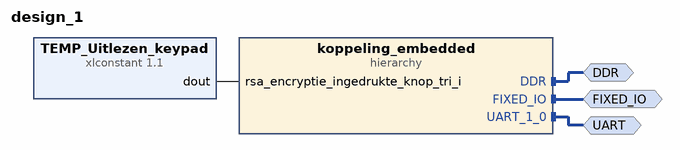
[diagram p0: block diagram of the top level]
# Vivado block design design_1, xc7z020clg400-1, Vivado 2023.1
create_bd_design design_1

create_bd_intf_port -mode Master -vlnv xilinx.com:interface:ddrx_rtl:1.0 DDR
create_bd_intf_port -mode Master -vlnv xilinx.com:display_processing_system7:fixedio_rtl:1.0 FIXED_IO
create_bd_intf_port -mode Master -vlnv xilinx.com:interface:uart_rtl:1.0 UART

create_bd_cell -type hier koppeling_embedded
create_bd_cell -type ip -vlnv xilinx.com:ip:xlconstant:1.1 TEMP_Uitlezen_keypad
set_property -dict {CONFIG.CONST_VAL 8 CONFIG.CONST_WIDTH 4} [get_bd_cells TEMP_Uitlezen_keypad]

# ---- hierarchy /koppeling_embedded ----
current_bd_instance /koppeling_embedded
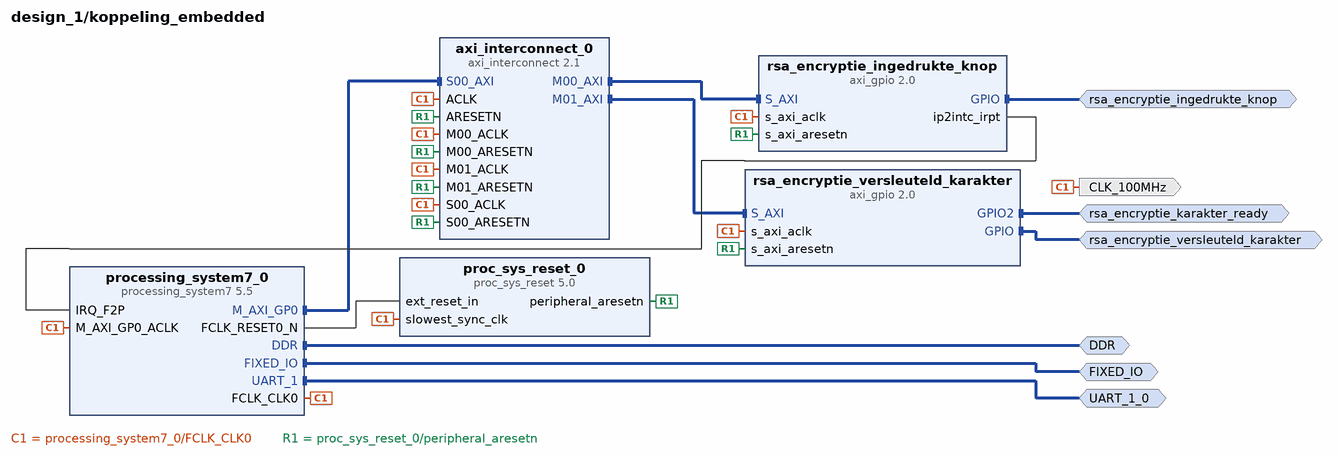
[diagram p1: block diagram inside /koppeling_embedded]
create_bd_intf_pin -mode Master -vlnv xilinx.com:interface:ddrx_rtl:1.0 DDR
create_bd_intf_pin -mode Master -vlnv xilinx.com:display_processing_system7:fixedio_rtl:1.0 FIXED_IO
create_bd_intf_pin -mode Master -vlnv xilinx.com:interface:gpio_rtl:1.0 rsa_encryptie_ingedrukte_knop
create_bd_intf_pin -mode Master -vlnv xilinx.com:interface:uart_rtl:1.0 UART_1_0
create_bd_intf_pin -mode Master -vlnv xilinx.com:interface:gpio_rtl:1.0 rsa_encryptie_versleuteld_karakter
create_bd_intf_pin -mode Master -vlnv xilinx.com:interface:gpio_rtl:1.0 rsa_encryptie_karakter_ready
create_bd_pin -dir O -type clk CLK_100MHz

create_bd_cell -type ip -vlnv xilinx.com:ip:axi_interconnect:2.1 axi_interconnect_0
create_bd_cell -type ip -vlnv xilinx.com:ip:proc_sys_reset:5.0 proc_sys_reset_0
create_bd_cell -type ip -vlnv xilinx.com:ip:axi_gpio:2.0 rsa_encryptie_versleuteld_karakter
set_property -dict [list \
  CONFIG.C_ALL_OUTPUTS 1 \
  CONFIG.C_ALL_OUTPUTS_2 1 \
  CONFIG.C_GPIO2_WIDTH 1 \
  CONFIG.C_IS_DUAL 1 \
] [get_bd_cells rsa_encryptie_versleuteld_karakter]
create_bd_cell -type ip -vlnv xilinx.com:ip:axi_gpio:2.0 rsa_encryptie_ingedrukte_knop
set_property -dict [list \
  CONFIG.C_ALL_INPUTS 1 \
  CONFIG.C_GPIO_WIDTH 4 \
  CONFIG.C_INTERRUPT_PRESENT 1 \
] [get_bd_cells rsa_encryptie_ingedrukte_knop]
create_bd_cell -type ip -vlnv xilinx.com:ip:processing_system7:5.5 processing_system7_0
set_property -dict [list \
  CONFIG.PCW_APU_PERIPHERAL_FREQMHZ 650 \
  CONFIG.PCW_CRYSTAL_PERIPHERAL_FREQMHZ 50 \
  CONFIG.PCW_ENET0_PERIPHERAL_ENABLE 0 \
  CONFIG.PCW_FPGA0_PERIPHERAL_FREQMHZ 100 \
  CONFIG.PCW_FPGA1_PERIPHERAL_FREQMHZ 50 \
  CONFIG.PCW_GPIO_MIO_GPIO_ENABLE 1 \
  CONFIG.PCW_GPIO_MIO_GPIO_IO MIO \
  CONFIG.PCW_I2C_RESET_ENABLE 0 \
  CONFIG.PCW_IRQ_F2P_INTR 1 \
  CONFIG.PCW_M_AXI_GP0_FREQMHZ 10 \
  CONFIG.PCW_PERIPHERAL_BOARD_PRESET part0 \
  CONFIG.PCW_PRESET_BANK1_VOLTAGE {LVCMOS 1.8V} \
  CONFIG.PCW_QSPI_GRP_FBCLK_ENABLE 1 \
  CONFIG.PCW_QSPI_GRP_FBCLK_IO {MIO 8} \
  CONFIG.PCW_QSPI_GRP_SINGLE_SS_ENABLE 1 \
  CONFIG.PCW_QSPI_GRP_SINGLE_SS_IO {MIO 1 .. 6} \
  CONFIG.PCW_QSPI_PERIPHERAL_ENABLE 1 \
  CONFIG.PCW_QSPI_QSPI_IO {MIO 1 .. 6} \
  CONFIG.PCW_SD0_PERIPHERAL_ENABLE 0 \
  CONFIG.PCW_SINGLE_QSPI_DATA_MODE x4 \
  CONFIG.PCW_UART0_PERIPHERAL_ENABLE 1 \
  CONFIG.PCW_UART0_UART0_IO {MIO 14 .. 15} \
  CONFIG.PCW_UART1_PERIPHERAL_ENABLE 1 \
  CONFIG.PCW_UART1_UART1_IO EMIO \
  CONFIG.PCW_UART_PERIPHERAL_FREQMHZ 100 \
  CONFIG.PCW_UIPARAM_DDR_BUS_WIDTH {16 Bit} \
  CONFIG.PCW_UIPARAM_DDR_FREQ_MHZ 525 \
  CONFIG.PCW_UIPARAM_DDR_PARTNO {MT41J256M16 RE-125} \
  CONFIG.PCW_USB0_PERIPHERAL_ENABLE 0 \
  CONFIG.PCW_USB_RESET_ENABLE 1 \
  CONFIG.PCW_USE_FABRIC_INTERRUPT 1 \
] [get_bd_cells processing_system7_0]
# 490 more settings of processing_system7_0 are not shown: defaults, MIO pin electricals, DDR timing, and values the tool derives

# ---- connections ----

current_bd_instance /koppeling_embedded
connect_bd_intf_net [get_bd_intf_pins processing_system7_0/DDR] [get_bd_intf_pins DDR]
connect_bd_intf_net [get_bd_intf_pins processing_system7_0/FIXED_IO] [get_bd_intf_pins FIXED_IO]
connect_bd_intf_net [get_bd_intf_pins rsa_encryptie_ingedrukte_knop/GPIO] [get_bd_intf_pins rsa_encryptie_ingedrukte_knop]
connect_bd_intf_net [get_bd_intf_pins rsa_encryptie_versleuteld_karakter/GPIO2] [get_bd_intf_pins rsa_encryptie_karakter_ready]
connect_bd_intf_net [get_bd_intf_pins processing_system7_0/UART_1] [get_bd_intf_pins UART_1_0]
connect_bd_intf_net [get_bd_intf_pins rsa_encryptie_versleuteld_karakter/GPIO] [get_bd_intf_pins rsa_encryptie_versleuteld_karakter]
connect_bd_intf_net [get_bd_intf_pins axi_interconnect_0/S00_AXI] [get_bd_intf_pins processing_system7_0/M_AXI_GP0]
connect_bd_intf_net [get_bd_intf_pins axi_interconnect_0/M00_AXI] [get_bd_intf_pins rsa_encryptie_ingedrukte_knop/S_AXI]
connect_bd_intf_net [get_bd_intf_pins axi_interconnect_0/M01_AXI] [get_bd_intf_pins rsa_encryptie_versleuteld_karakter/S_AXI]
connect_bd_net -net S00_ACLK_1 [get_bd_pins processing_system7_0/FCLK_CLK0] \
  [get_bd_pins axi_interconnect_0/S00_ACLK] [get_bd_pins axi_interconnect_0/M00_ACLK] \
  [get_bd_pins axi_interconnect_0/M01_ACLK] [get_bd_pins axi_interconnect_0/ACLK] \
  [get_bd_pins proc_sys_reset_0/slowest_sync_clk] [get_bd_pins processing_system7_0/M_AXI_GP0_ACLK] \
  [get_bd_pins rsa_encryptie_ingedrukte_knop/s_axi_aclk] [get_bd_pins rsa_encryptie_versleuteld_karakter/s_axi_aclk] \
  [get_bd_pins CLK_100MHz]
connect_bd_net [get_bd_pins proc_sys_reset_0/peripheral_aresetn] \
  [get_bd_pins axi_interconnect_0/S00_ARESETN] [get_bd_pins axi_interconnect_0/M00_ARESETN] \
  [get_bd_pins axi_interconnect_0/M01_ARESETN] [get_bd_pins axi_interconnect_0/ARESETN] \
  [get_bd_pins rsa_encryptie_ingedrukte_knop/s_axi_aresetn] [get_bd_pins rsa_encryptie_versleuteld_karakter/s_axi_aresetn]
connect_bd_net [get_bd_pins processing_system7_0/FCLK_RESET0_N] [get_bd_pins proc_sys_reset_0/ext_reset_in]
connect_bd_net [get_bd_pins rsa_encryptie_ingedrukte_knop/ip2intc_irpt] [get_bd_pins processing_system7_0/IRQ_F2P]

current_bd_instance /
connect_bd_intf_net [get_bd_intf_ports DDR] [get_bd_intf_pins koppeling_embedded/DDR]
connect_bd_intf_net [get_bd_intf_ports FIXED_IO] [get_bd_intf_pins koppeling_embedded/FIXED_IO]
connect_bd_intf_net [get_bd_intf_ports UART] [get_bd_intf_pins koppeling_embedded/UART_1_0]
connect_bd_net -net rsa_encryptie_ingedrukte_knop_tri_i_1 [get_bd_pins TEMP_Uitlezen_keypad/dout] \
  [get_bd_pins koppeling_embedded/rsa_encryptie_ingedrukte_knop_tri_i]

# ---- address map ----
assign_bd_address -offset 0x41200000 -range 64K -target_address_space [get_bd_addr_spaces koppeling_embedded/processing_system7_0/Data] [get_bd_addr_segs koppeling_embedded/rsa_encryptie_ingedrukte_knop/S_AXI/Reg]
assign_bd_address -offset 0x41210000 -range 64K -target_address_space [get_bd_addr_spaces koppeling_embedded/processing_system7_0/Data] [get_bd_addr_segs koppeling_embedded/rsa_encryptie_versleuteld_karakter/S_AXI/Reg]

validate_bd_design
save_bd_design
